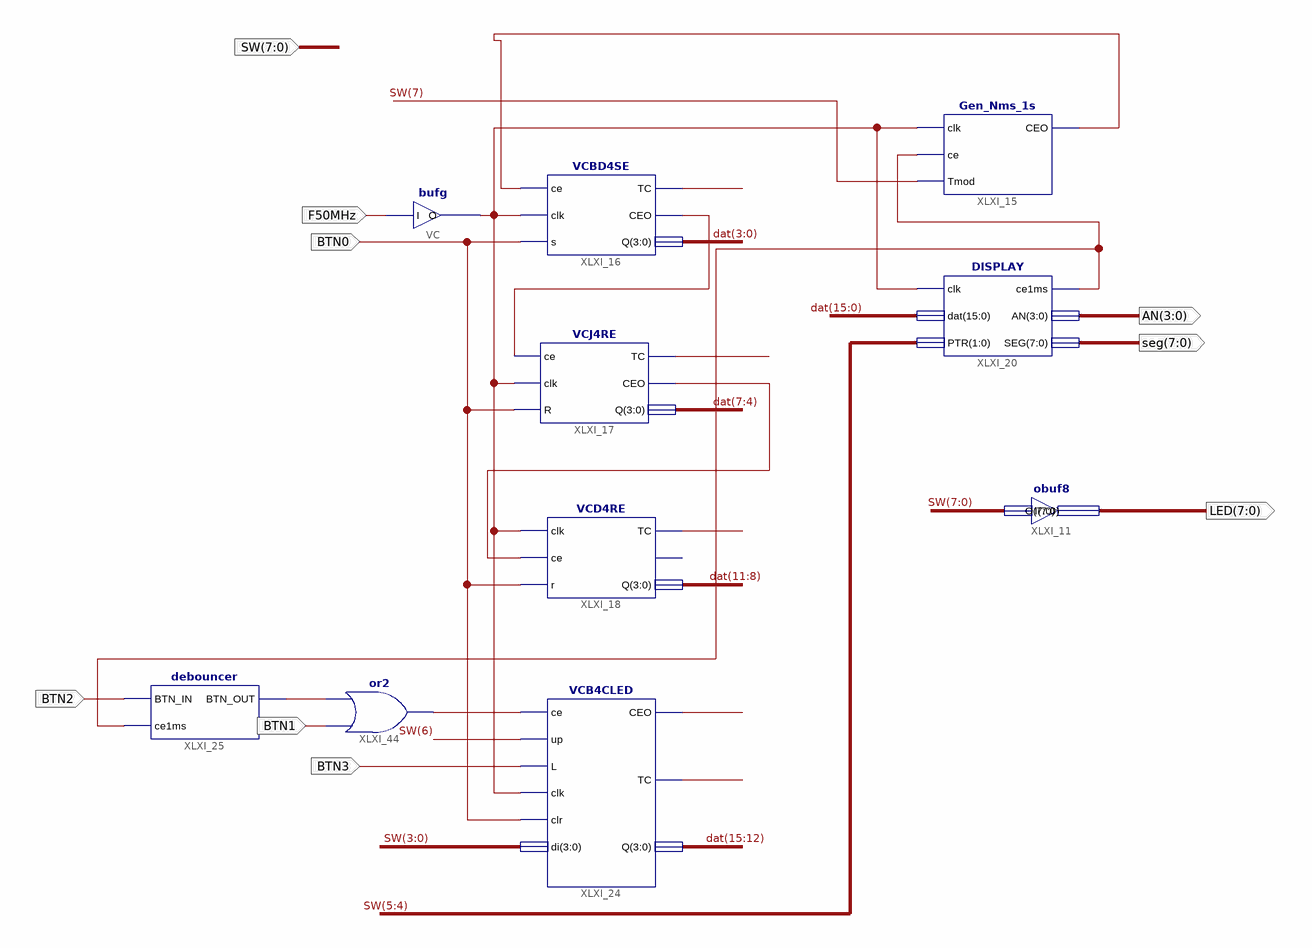
[diagram p0: schematic sheet 1]
// Xilinx ISE schematic Sch1.sch (spartan3e) as structural Verilog: 10 symbols, 9 ports
module Sch1 (
  input  [7:0] SW,
  input  BTN0,
  input  BTN3,
  input  F50MHz,
  input  BTN2,
  input  BTN1,
  output [3:0] AN,
  output [7:0] seg,
  output [7:0] LED
);

  wire XLXN_24, XLXN_25, XLXN_27, XLXN_29, XLXN_31, XLXN_37, XLXN_42, XLXN_43, XLXN_45, XLXN_49, XLXN_140,
       XLXN_141;
  wire [15:0] dat;

  obuf8 XLXI_11 (.I(SW), .O(LED));
  bufg VC (.I(F50MHz), .O(XLXN_42));
  Gen_Nms_1s XLXI_15 (.clk(XLXN_42), .ce(XLXN_49), .Tmod(SW[7]), .CEO(XLXN_37));
  VCBD4SE XLXI_16 (.ce(XLXN_37), .clk(XLXN_42), .s(BTN0), .TC(XLXN_31), .CEO(XLXN_43), .Q(dat[3:0]));
  VCJ4RE XLXI_17 (.ce(XLXN_43), .clk(XLXN_42), .R(BTN0), .TC(XLXN_29), .CEO(XLXN_45), .Q(dat[7:4]));
  VCD4RE XLXI_18 (.clk(XLXN_42), .ce(XLXN_45), .r(BTN0), .TC(XLXN_27), .Q(dat[11:8]));  // open: CEO
  DISPLAY XLXI_20 (.clk(XLXN_42), .dat(dat), .PTR(SW[5:4]), .ce1ms(XLXN_49), .AN(AN), .SEG(seg));
  VCB4CLED XLXI_24 (
    .ce(XLXN_141), .up(SW[6]), .L(BTN3), .clk(XLXN_42), .clr(BTN0), .di(SW[3:0]), .CEO(XLXN_25),
    .TC(XLXN_24), .Q(dat[15:12]));
  debouncer XLXI_25 (.BTN_IN(BTN2), .ce1ms(XLXN_49), .BTN_OUT(XLXN_140));
  or XLXI_44 (XLXN_141, BTN1, XLXN_140);
endmodule
